# Altium schematic sheet Mainboard.SchDoc
size A3
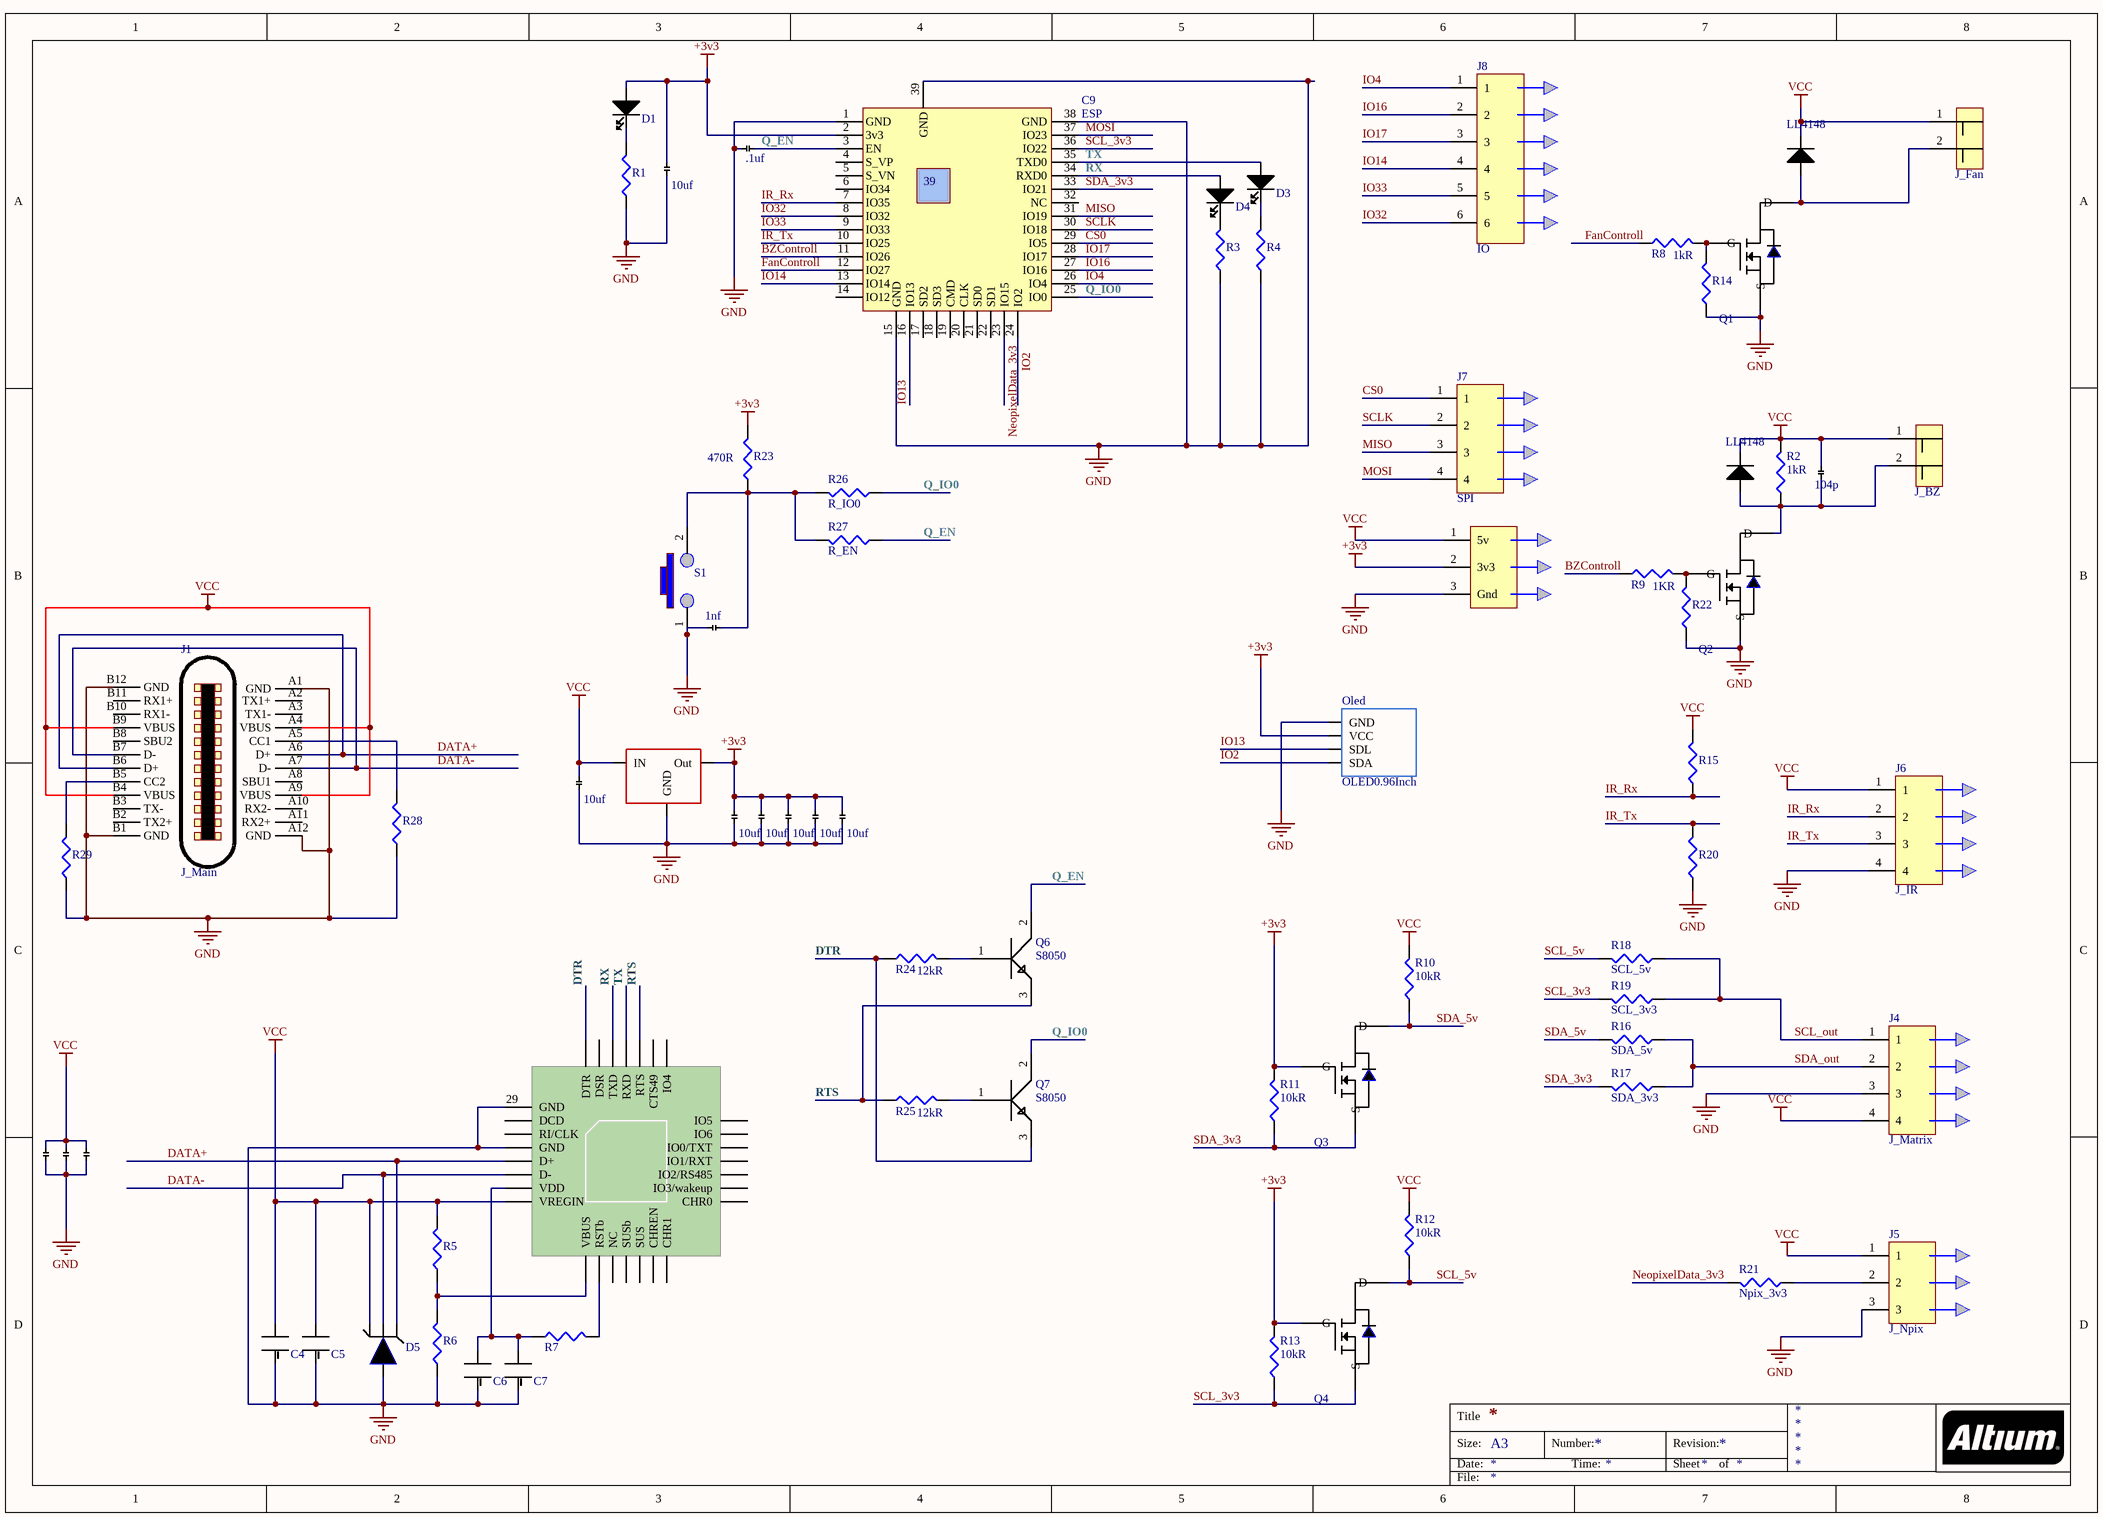
[diagram p0: Mainboard.SchDoc]

## Parts
C1  104p  [Capacitor0805]
C2  104p  [Capacitor0805]  (value not drawn)
C3  104p  [Capacitor0805]  (value not drawn)
C4  C4R7  [Capacitor0603]  (value not drawn)
C5  C104  [Capacitor0603]  (value not drawn)
C6  C104  [Capacitor0603]  (value not drawn)
C7  C4R7  [Capacitor0603]  (value not drawn)
C8  104p  [Capacitor0805]  (value not drawn)
C9  ESP  [ESP_WROOM_32_BARED_CHIP]
C10  1nf  [Capacitor0805]
C11  10uf  [Capacitor0805]
C12  10uf  [Capacitor0805]
C13  10uf  [Capacitor0805]
C14  10uf  [Capacitor0805]
C15  10uf  [Capacitor0805]
C16  10uf  [Capacitor0805]
C17  10uf  [Capacitor0805]
C18  .1uf  [Capacitor0805]
cp1  CP2102N  [CP2102N_QFN28]  (value not drawn)
D1  ESP  [LED0603]  (value not drawn)
D2  LL4148  [SOD80-LL4148]
D3  TXD  [LED0603]  (value not drawn)
D4  RXD  [LED0603]  (value not drawn)
D5  SP0503BAHTG  [SP0503BAHTG - SOT143-4]  (value not drawn)
D6  LL4148  [SOD80-LL4148]
J1  J_Main  [USB_C_24P_SMT]
J2  J_BZ  [1x2 S2B-XH]
J3  J_Fan  [1x2 S2B-XH]
J4  J_Matrix  [1x4 DUPONT RightAngle]
J5  J_Npix  [1x3 2.54 big chunk verticle]
J6  J_IR  [Xh 2.54 4 Pin Right]
J7  SPI  [1x4 DUPONT RightAngle]
J8  IO  [1x6 dupont right angle]
J9  power  [1x3 dupont right angle]  (value not drawn)
Oled  OLED0.96Inch  [0.96OLED]
Q1  Bss133  [SOT_23]  (value not drawn)
Q2  Bss133  [SOT_23]  (value not drawn)
Q3  Bss133  [SOT_23]  (value not drawn)
Q4  Bss133  [SOT_23]  (value not drawn)
Q5  lm1117  [SOT-223]  (value not drawn)
Q6  S8050  [SOT_23]
Q7  S8050  [SOT_23]
R1  360R  [R0805]  (value not drawn)
R2  1kR  [R0805]
R3  R360  [R0805]  (value not drawn)
R4  R360  [R0805]  (value not drawn)
R5  R2212  [R0805]  (value not drawn)
R6  R4752  [R0805]  (value not drawn)
R7  R102  [R0805]  (value not drawn)
R8  1kR  [R0805]
R9  1KR  [R0805]
R10  10kR  [R0805]
R11  10kR  [R0805]
R12  10kR  [R0805]
R13  10kR  [R0805]
R14  10kR  [R0805]  (value not drawn)
R15  10kR  [R0805]  (value not drawn)
R16  SDA_5v  [R0805]
R17  SDA_3v3  [R0805]
R18  SCL_5v  [R0805]
R19  SCL_3v3  [R0805]
R20  10kR  [R0805]  (value not drawn)
R21  Npix_3v3  [R0805]
R22  10kR  [R0805]  (value not drawn)
R23  470R  [R0805]
R24  12kR  [R0805]
R25  12kR  [R0805]
R26  R_IO0  [R0805]
R27  R_EN  [R0805]
R28  R5.1k  [R0805]  (value not drawn)
R29  R5.1k  [R0805]  (value not drawn)
S1  RST  (value not drawn)

## Nets
+3v3: C9.2(3v3) C12.1(-) C13.1(-) C14.1(-) C15.1(-) C16.1(-) C17.1(-) D1.2 J9.2(3v3) Oled.2(VCC) Q3.1(G) Q4.1(G) Q5.2(Out) R11.2 R13.2 R23.2
GND: C2.1(-) C3.1(-) C4.1(-) C5.1(-) C6.1(-) C7.1(-) C8.1(-) C9.1(GND) C9.15(GND) C9.38(GND) C9.39(GND) C10.2(+) C11.2(+) C12.2(+) C13.2(+) C14.2(+) C15.2(+) C16.2(+) C17.2(+) C18.1(-) cp1.3(GND) cp1.29(GND) D5.1(+) J1.A1(GND) J1.A12(GND) J1.B1(GND) J1.B12(GND) J4.3 J5.3 J6.4 J9.3(Gnd) Oled.1(GND) Q1.3(S) Q2.3(S) Q5.1(GND) R1.1 R3.1 R4.1 R6.1 R14.1 R20.1 R22.1 R28.1 R29.1 S1.1
VCC: C1.2(+) C2.2(+) C3.2(+) C4.2(+) C5.2(+) C8.2(+) C11.1(-) cp1.7(VREGIN) D2.1 D5.4 D6.1 J1.A4(VBUS) J1.A9(VBUS) J1.B4(VBUS) J1.B9(VBUS) J2.1 J3.1 J4.4 J5.1 J6.1 J9.1(5v) Q5.3(IN) R2.2 R5.2 R10.2 R12.2 R15.2
BZControll: C9.11(IO26) R9.1
CS0: C9.29(IO5) J7.1
DATA+: cp1.4(D+) D5.2 J1.A6(D+) J1.B6(D+)
DATA-: cp1.5(D-) D5.3 J1.A7(D-) J1.B7(D-)
DTR: cp1.28(DTR) Q7.3 R24.1
FanControll: C9.12(IO27) R8.1
IO2: C9.24(IO2) Oled.4(SDA)
IO4: C9.26(IO4) J8.1
IO13: C9.16(IO13) Oled.3(SDL)
IO14: C9.13(IO14) J8.4
IO16: C9.27(IO16) J8.2
IO17: C9.28(IO17) J8.3
IO32: C9.8(IO32) J8.6
IO33: C9.9(IO33) J8.5
IR_Rx: C9.7(IO35) J6.2 R15.1
IR_Tx: C9.10(IO25) J6.3 R20.2
MISO: C9.31(IO19) J7.3
MOSI: C9.37(IO23) J7.4
NeopixelData_3v3: C9.23(IO15) R21.2
Q_EN: C9.3(EN) C18.2(+) Q6.2 R27.1
Q_IO0: C9.25(IO0) Q7.2 R26.1
RTS: cp1.24(RTS) Q6.3 R25.1
RX: C9.34(RXD0) cp1.26(TXD) D4.2
SCL_3v3: C9.36(IO22) Q4.3(S) R13.1 R19.2
SCL_5v: Q4.2(D) R12.1 R18.2
SCL_out: J4.1 R18.1 R19.1
SCLK: C9.30(IO18) J7.2
SDA_3v3: C9.33(IO21) Q3.3(S) R11.1 R17.2
SDA_5v: Q3.2(D) R10.1 R16.2
SDA_out: J4.2 R16.1 R17.1
TX: C9.35(TXD0) cp1.25(RXD) D3.2
NetC1_1: C1.1(-) D6.2 J2.2 Q2.2(D) R2.1
NetC6_2: C6.2(+) C7.2(+) cp1.6(VDD) R7.1
NetC10_1: C10.1(-) R23.1 R26.2 R27.2 S1.2
Netcp1_8: cp1.8(VBUS) R5.1 R6.2
Netcp1_9: cp1.9(RSTb) R7.2
NetD1_1: D1.1 R1.2
NetD2_2: D2.2 J3.2 Q1.2(D)
NetD3_1: D3.1 R4.2
NetD4_1: D4.1 R3.2
NetJ1_A5: J1.A5(CC1) R28.2
NetJ1_B5: J1.B5(CC2) R29.2
NetJ5_2: J5.2 R21.1
NetQ1_1: Q1.1(G) R8.2 R14.2
NetQ2_1: Q2.1(G) R9.2 R22.2
NetQ6_1: Q6.1 R24.2
NetQ7_1: Q7.1 R25.2

Not connected (* = marked no-connect by the designer): C9 4(S_VP) 5(S_VN) 6(IO34) 14(IO12) 17(SD2) 18(SD3) 19(CMD) 20(CLK) 21(SD0) 22(SD1) 32(NC); cp1 1(DCD) 2(RI/CLK) 10(NC) 11(SUSb) 12(SUS) 13(CHREN) 14(CHR1) 15(CHR0) 16(IO3/wakeup) 17(IO2/RS485) 18(IO1/RXT) 19(IO0/TXT) 20(IO6) 21(IO5) 22(IO4) 23(CTS49) 27(DSR); J1 A2(TX1+) A3(TX1-) A8(SBU1) A10(RX2-) A11(RX2+) B2(TX2+) B3(TX-) B8(SBU2) B10(RX1-) B11(RX1+)

## Notes on the sheet
- Title
- Size:
- Date:
- A3
- Number:
- Time:
- Revision:
- Sheet
- of
- File:

## Library data of the parts
C1-C3 C8 C10-C18 = capacitor0.1uf: for leds and smol
C4 = capacitor0603: Cap Ceramic 4.7uF 6.3V X5R 20% Pad SMD 0402 85C T/R; Manufacturer 1: Murata; Manufacturer Part Number 1: GRM155R60J475ME87J; Supplier 1: Digi-Key; RoHS: No; Category: Ceramic Capacitors; Stock 1: 206568; Pricing 1: 1=0.16000, 10=0.11100, 50=0.06280, 100=0.05210, 500=0.03654, 1000=0.03025, 2500=0.02815, 5000=0.02575 (USD); Capacitance: 4.7uF; Tolerance: 20%; Dielectric: X5R; Voltage Rating (DC): 6.3V; Length: 1mm; Thickness: 500um; Width: 500um; ComponentLink1URL: https://search.murata.co.jp/Ceramy/image/img/A01X/G101/ENG/GRM155R60J475ME87-01.pdf?src-supplier=Digi-Key; ComponentLink1Description: https://search.murata.co.jp/Ceramy/image/img/A01X/G101/ENG/GRM155R60J475ME87-01.pdf?src-supplier=Digi-Key; Supplier Part Number 1: 490-18211-1-ND
C5 = capacitor0603: 0.1uf; Manufacturer 1: Murata; Manufacturer Part Number 1: GRM155R60J475ME87J; Capacitance: 4.7uF; Tolerance: 20%; Dielectric: X5R; Voltage Rating (DC): 6.3V; Supplier 1: Digi-Key; RoHS: No; Category: Ceramic Capacitors; Stock 1: 206568; Pricing 1: 1=0.16000, 10=0.11100, 50=0.06280, 100=0.05210, 500=0.03654, 1000=0.03025, 2500=0.02815, 5000=0.02575 (USD); Length: 1mm; Thickness: 500um; Width: 500um; ComponentLink1URL: https://search.murata.co.jp/Ceramy/image/img/A01X/G101/ENG/GRM155R60J475ME87-01.pdf?src-supplier=Digi-Key; ComponentLink1Description: https://search.murata.co.jp/Ceramy/image/img/A01X/G101/ENG/GRM155R60J475ME87-01.pdf?src-supplier=Digi-Key; Supplier Part Number 1: 490-18211-1-ND
C6 = capacitor0603: 4.7; Manufacturer 1: Murata; Manufacturer Part Number 1: GRM155R60J475ME87J; Capacitance: 4.7uF; Tolerance: 20%; Dielectric: X5R; Voltage Rating (DC): 6.3V; Supplier 1: Digi-Key; RoHS: No; Category: Ceramic Capacitors; Stock 1: 206568; Pricing 1: 1=0.16000, 10=0.11100, 50=0.06280, 100=0.05210, 500=0.03654, 1000=0.03025, 2500=0.02815, 5000=0.02575 (USD); Length: 1mm; Thickness: 500um; Width: 500um; ComponentLink1URL: https://search.murata.co.jp/Ceramy/image/img/A01X/G101/ENG/GRM155R60J475ME87-01.pdf?src-supplier=Digi-Key; ComponentLink1Description: https://search.murata.co.jp/Ceramy/image/img/A01X/G101/ENG/GRM155R60J475ME87-01.pdf?src-supplier=Digi-Key; Supplier Part Number 1: 490-18211-1-ND
C7 = capacitor0603: 0.1; Manufacturer 1: Murata; Manufacturer Part Number 1: GRM155R60J475ME87J; Capacitance: 4.7uF; Tolerance: 20%; Dielectric: X5R; Voltage Rating (DC): 6.3V; Supplier 1: Digi-Key; RoHS: No; Category: Ceramic Capacitors; Stock 1: 206568; Pricing 1: 1=0.16000, 10=0.11100, 50=0.06280, 100=0.05210, 500=0.03654, 1000=0.03025, 2500=0.02815, 5000=0.02575 (USD); Length: 1mm; Thickness: 500um; Width: 500um; ComponentLink1URL: https://search.murata.co.jp/Ceramy/image/img/A01X/G101/ENG/GRM155R60J475ME87-01.pdf?src-supplier=Digi-Key; ComponentLink1Description: https://search.murata.co.jp/Ceramy/image/img/A01X/G101/ENG/GRM155R60J475ME87-01.pdf?src-supplier=Digi-Key; Supplier Part Number 1: 490-18211-1-ND
C9 = ESP_wroom32_bared_chip
cp1 = CP2102N-A02-GQFN28R: Full Speed USB to UART Bridge USB 2.0 3.3V T/R Automotive 28-Pin QFN EP; Manufacturer 1: Silicon Labs; Supplier 1: Digi-Key; Manufacturer Part Number 1: CP2102N-A02-GQFN28R; RoHS: No; Stock 1: 1682; Pricing 1: 1=1.40000, 25=1.35160, 100=1.29950 (USD); Supplier Part Number 1: 336-5890-1-ND
D1 D3 D4 = LTST-C190TBKT: LED BLUE CLEAR CHIP SMD; Manufacturer 1: Vishay Lite-On; Lens Color: Colorless; Viewing Angle: 130°; Forward Voltage: 3.8V; Lens Style: Diffused,Colorless,Clear,Rectangular; Luminous Intensity: 180mcd; Forward Current: 20mA; Dominant Wavelength: 475nm; Number of Elements: 1; Power Dissipation: 76mW; Wavelength: 468nm; Reverse Voltage: 5V; Supplier 1: Digi-Key; Manufacturer Part Number 1: LTST-C190TBKT; RoHS: Yes; Category: LEDs; Stock 1: 76203; Pricing 1: 1=0.50000, 10=0.35600, 100=0.15840, 500=0.11088, 1000=0.09108 (USD); Mount: Surface Mount; Case/Package: 0603; Number of Pins: 2; Color: Blue; Case Code (Metric): 1608; Case Code (Imperial): 0603; Min Operating Temperature: -20°C; Max Operating Temperature: 80°C; Packaging: Tape and Reel; Package Quantity: 1; Illumination Color: Blue; Test Current: 20mA; Lens Transparency: Clear; Number of LEDs: 1; Length: 1.6mm; Height: 0.8mm; Width: 0.8mm; Depth: 0.8mm; Radiation Hardening: No; Lead Free: Lead Free; ComponentLink1URL: https://datasheet.ciiva.com/16353/lite-on20ltst-c190tbkt-16353409.pdf?src-supplier=Future+Electronics; ComponentLink1Description: https://datasheet.ciiva.com/16353/lite-on20ltst-c190tbkt-16353409.pdf?src-supplier=Future+Electronics; ComponentLink2URL: https://datasheet.ciiva.com/15117/getdatasheetpartid-131310-15117667.pdf?src-supplier=Verical; ComponentLink2Description: https://datasheet.ciiva.com/15117/getdatasheetpartid-131310-15117667.pdf?src-supplier=Verical; ComponentLink3URL: https://datasheet.ciiva.com/2110/ltst-c190tbkt-2110473.pdf?src-supplier=Digi-Key; ComponentLink3Description: https://datasheet.ciiva.com/2110/ltst-c190tbkt-2110473.pdf?src-supplier=Digi-Key; ComponentLink4URL: https://datasheet.ciiva.com/12400/lite-on-ltst-c190tbkt-187381-12400873.pdf?src-supplier=Mouser; ComponentLink4Description: https://datasheet.ciiva.com/12400/lite-on-ltst-c190tbkt-187381-12400873.pdf?src-supplier=Mouser; ComponentLink5URL: https://datasheet.ciiva.com/11774/0900766b80dc02ab-11774378.pdf?src-supplier=RSComponents; ComponentLink5Description: https://datasheet.ciiva.com/11774/0900766b80dc02ab-11774378.pdf?src-supplier=RSComponents; ComponentLink6URL: https://datasheet.ciiva.com/26913/ltst-c190tbkt-26913716.pdf?src-supplier=IIIC; ComponentLink6Description: https://datasheet.ciiva.com/26913/ltst-c190tbkt-26913716.pdf?src-supplier=IIIC; ComponentLink7URL: https://datasheet.ciiva.com/2110/s-110-ltst-c190tbkt0630-2110475.pdf?src-supplier=Digi-Key; ComponentLink7Description: https://datasheet.ciiva.com/2110/s-110-ltst-c190tbkt0630-2110475.pdf?src-supplier=Digi-Key; ComponentLink8Description: 橘色的; ComponentLink8URL: https://www.digikey.tw/product-detail/zh/lite-on-inc/LTST-C191KFKT/160-1445-1-ND/386832
D2 D6 = LL4148: ON SEMICONDUCTOR - LL4148 - Small Signal Diode, Single, 100 V, 200 mA, 1 V, 4 ns, 2 A; Manufacturer 1: ON Semiconductor / Fairchild; Average Rectified Current: 200mA; Max Repetitive Reverse Voltage (Vrrm): 100V; Max Surge Current: 2A; Forward Voltage: 1V; Max Reverse Current: 25nA; Recovery Time: 4ns; Power Dissipation: 500mW; Supplier 1: Digi-Key; Manufacturer Part Number 1: LL4148; RoHS: Yes; Category: Rectifier Diodes; Stock 1: 428902; Pricing 1: 1=0.10000, 10=0.08400, 100=0.03220, 500=0.02346, 1000=0.01575 (USD); Mount: Surface Mount; Number of Pins: 2; Weight: 0.01lb; Contact Plating: Tin,Matte; Min Operating Temperature: -65°C; Max Operating Temperature: 175°C; Packaging: Tape and Reel; Package Quantity: 2500; Forward Current: 200mA; Reverse Recovery Time: 4ns; Peak Non-Repetitive Surge Current: 2A; Max Forward Surge Current (Ifsm): 2A; Element Configuration: Single; Voltage: 100V; Max Reverse Voltage (DC): 100V; Reverse Voltage: 100V; Length: 3.6mm; Width: 1.5mm; Height: 1.5mm; Radiation Hardening: No; REACH SVHC: No SVHC; Lead Free: Lead Free; ComponentLink1URL: https://datasheet.ciiva.com/1181/1730036-1181026.pdf?src-supplier=Element14; ComponentLink1Description: https://datasheet.ciiva.com/1181/1730036-1181026.pdf?src-supplier=Element14; ComponentLink2URL: https://datasheet.ciiva.com/8303/ll4148-8303779.pdf?src-supplier=Avnet; ComponentLink2Description: https://datasheet.ciiva.com/8303/ll4148-8303779.pdf?src-supplier=Avnet; ComponentLink3URL: https://datasheet.ciiva.com/27048/94908-27048041.pdf?src-supplier=Jameco; ComponentLink3Description: https://datasheet.ciiva.com/27048/94908-27048041.pdf?src-supplier=Jameco; ComponentLink4URL: https://datasheet.ciiva.com/4453/ll4148-70504-4453114.pdf?src-supplier=Mouser; ComponentLink4Description: https://datasheet.ciiva.com/4453/ll4148-70504-4453114.pdf?src-supplier=Mouser; ComponentLink5URL: https://datasheet.ciiva.com/910/ll4148-910343.pdf?src-supplier=Digi-Key; ComponentLink5Description: https://datasheet.ciiva.com/910/ll4148-910343.pdf?src-supplier=Digi-Key; ComponentLink6URL: https://datasheet.ciiva.com/910/ll4148-910344.pdf?src-supplier=Digi-Key; ComponentLink6Description: https://datasheet.ciiva.com/910/ll4148-910344.pdf?src-supplier=Digi-Key; ComponentLink7URL: https://datasheet.ciiva.com/910/ll4148-910345.pdf?src-supplier=Digi-Key; ComponentLink7Description: https://datasheet.ciiva.com/910/ll4148-910345.pdf?src-supplier=Digi-Key; ComponentLink8URL: https://datasheet.ciiva.com/22735/1896420-22735578.pdf?src-supplier=Element14; ComponentLink8Description: https://datasheet.ciiva.com/22735/1896420-22735578.pdf?src-supplier=Element14; ComponentLink9URL: https://datasheet.ciiva.com/26912/getdatasheetpartid-110057-26912779.pdf?src-supplier=Verical; ComponentLink9Description: https://datasheet.ciiva.com/26912/getdatasheetpartid-110057-26912779.pdf?src-supplier=Verical; ComponentLink10URL: https://datasheet.ciiva.com/8053/1896420-8053645.pdf?src-supplier=Element14; ComponentLink10Description: https://datasheet.ciiva.com/8053/1896420-8053645.pdf?src-supplier=Element14; Supplier Part Number 1: LL4148FSCT-ND
D5 = SP0503BAHTG: ESD Suppressor TVS 5.5V 4-Pin(3+Tab) SOT-143 T/R; Manufacturer 1: Littelfuse; Element Configuration: Common Anode; Direction: Unidirectional; Capacitance: 30pF; Number of Channels: 3; Clamping Voltage: 8.5V; Power Line Protection: No; Polarity: Bidirectional,Unidirectional; Max Power Dissipation: 225mW; ESD Protection: Yes; Max Reverse Leakage Current: 100nA; Voltage Rating (DC): 5V; Diode Type: Avalanche; Supplier 1: Digi-Key; Manufacturer Part Number 1: SP0503BAHTG; RoHS: Yes; Category: Diodes; Stock 1: 63906; Pricing 1: 1=0.80000, 10=0.66000, 100=0.51120, 500=0.38340, 1000=0.30885 (USD); Mount: Surface Mount; Case/Package: SOT-143; Number of Pins: 4; Min Operating Temperature: -40°C; Max Operating Temperature: 85°C; Operating Supply Voltage: 5.5V; Packaging: Tape and Reel; Number of Unidirectional Channels: 3; Reverse Standoff Voltage: 5.5V; Breakdown Voltage: 5.5V; Termination: SMD/SMT; Working Voltage: 5.5V; Peak Pulse Power: 225mW; Leakage Current: 100nA; Number of Elements: 3; Power Dissipation: 225mW; Resistor Type: Zener; Length: 3.04mm; Height: 1.05mm; Width: 1.4mm; Depth: 1.4mm; Radiation Hardening: No; REACH SVHC: No SVHC; Lead Free: Lead Free; ComponentLink1URL: https://datasheet.ciiva.com/15143/getdatasheetpartid-116020-15143550.pdf?src-supplier=Verical; ComponentLink1Description: https://datasheet.ciiva.com/15143/getdatasheetpartid-116020-15143550.pdf?src-supplier=Verical; ComponentLink2URL: https://datasheet.ciiva.com/332/sp05xxba-332550.pdf?src-supplier=Digi-Key; ComponentLink2Description: https://datasheet.ciiva.com/332/sp05xxba-332550.pdf?src-supplier=Digi-Key; ComponentLink3URL: https://datasheet.ciiva.com/8062/littefuse-spa-sp050x-8062422.pdf?src-supplier=Element14; ComponentLink3Description: https://datasheet.ciiva.com/8062/littefuse-spa-sp050x-8062422.pdf?src-supplier=Element14; ComponentLink4URL: https://datasheet.ciiva.com/22697/1911798-22697942.pdf?src-supplier=Element14; ComponentLink4Description: https://datasheet.ciiva.com/22697/1911798-22697942.pdf?src-supplier=Element14; ComponentLink5URL: https://datasheet.ciiva.com/332/sp05xxba-332551.pdf?src-supplier=Digi-Key; ComponentLink5Description: https://datasheet.ciiva.com/332/sp05xxba-332551.pdf?src-supplier=Digi-Key; ComponentLink6URL: https://datasheet.ciiva.com/16449/sp05xxba-16449463.pdf?src-supplier=Future+Electronics; ComponentLink6Description: https://datasheet.ciiva.com/16449/sp05xxba-16449463.pdf?src-supplier=Future+Electronics; ComponentLink7URL: https://datasheet.ciiva.com/332/sp05xxba-332552.pdf?src-supplier=Digi-Key; ComponentLink7Description: https://datasheet.ciiva.com/332/sp05xxba-332552.pdf?src-supplier=Digi-Key; ComponentLink8URL: https://datasheet.ciiva.com/4509/sp05x-leadfree-4509162.pdf?src-supplier=Mouser; ComponentLink8Description: https://datasheet.ciiva.com/4509/sp05x-leadfree-4509162.pdf?src-supplier=Mouser; ComponentLink9URL: https://datasheet.ciiva.com/7650/526672-7650894.pdf?src-supplier=Element14; ComponentLink9Description: https://datasheet.ciiva.com/7650/526672-7650894.pdf?src-supplier=Element14; Supplier Part Number 1: F2715CT-ND
J1 = USB_TypeC_24P: ComponentLink1Description: example; ComponentLink1URL: https://github.com/Xinyuan-LilyGO/TTGO-T-Display/blob/master/schematic/ESP32-TFT(6-26).pdf
J2 J3 = S2B-XH: ComponentLink1Description: Sales Page; ComponentLink1URL: https://www.digikey.com/en/products/detail/jst-sales-america-inc/S2B-XH-A-LF-SN/1651055; ComponentLink2Description: dataSheet; ComponentLink2URL: https://www.jst-mfg.com/product/pdf/eng/eXH.pdf
J4 = 1x4 dupont general
J5 = 1x3 2.54 chunk verticle: ComponentLink1Description: vender; ComponentLink1URL: https://www.digikey.tw/product-detail/zh/sullins-connector-solutions/SWR25X-NRTC-S03-RB-BA/S9403-ND/2769661; ComponentLink2Description: model; ComponentLink2URL: https://www.3dcontentcentral.tw/secure/Download-Partner-Model.aspx?partner=TraceParts&name=WR-WTB+2%2c54mm+Left+Angle+Header+3+pin&lang=zh&catalogid=11913&id=882182&parturl=https%3a%2f%2fwww.traceparts.com%2fels%2f3dcc%2fgoto%3fProduct%3d10-11012018-134514%26configuratorType%3dtable%26showBomFields%3dtrue%26showSlides%3d3Dviewer%2cPictures%2cDimensionDrawings%2cECAD%26tp_p1%3d%7b1%7d
J6 J7 = 1x4 general Header
J8 = 1x6 general dupont
J9 = 1x3 dupont power
Q1-Q4 = Bss138 Mosfet
Q5 = LM1117-3.3v
Q6 Q7 = S8050NPN
R1 = CRCW0805360RFKEA: Res Thick Film 0805 360 Ohm 1% 0.125W(1/8W) ±100ppm/C Molded SMD Automotive Paper T/R; Manufacturer 1: Vishay; Temperature Coefficient: 100ppm/°C; Max Power Dissipation: 125mW; Voltage Rating (DC): 150V; Supplier 1: Digi-Key; Manufacturer Part Number 1: CRCW0805360RFKEA; RoHS: Yes; Category: Chip SMD Resistors; Stock 1: 25005; Pricing 1: 1=0.10000, 10=0.06000, 100=0.02450, 1000=0.01102, 2500=0.00957 (USD); Case/Package: 0805; Number of Pins: 2; Weight: 0.000194oz; Case Code (Metric): 2012; Case Code (Imperial): 0805; Contact Plating: Tin; Number of Terminals: 2; Min Operating Temperature: -55°C; Max Operating Temperature: 155°C; Resistance: 360R; Tolerance: 1%; Packaging: Tape and Reel; Composition: Thick Film; Package Quantity: 10; Number of Terminations: 2; Features: Automotive AEC-Q200; Power Rating: 125mW; Voltage Rating: 150V; Termination: SMD/SMT; Military Standard: Not; Length: 2mm; Height: 0.45mm; Width: 0.049inch; Depth: 1.25mm; Radiation Hardening: No; Lead Free: Lead Free; REACH SVHC: Unknown; ComponentLink1URL: https://datasheet.ciiva.com/2467/dcrcwe3-2467773.pdf?src-supplier=Digi-Key; ComponentLink1Description: https://datasheet.ciiva.com/2467/dcrcwe3-2467773.pdf?src-supplier=Digi-Key; Supplier Part Number 1: 541-360CCT-ND
R2 R5 R6 R8-R13 R16-R19 R21 R24 R25 R28 R29 = resistor(CRCW0805360RFKEA: Res Thick Film 0805 360 Ohm 1% 0.125W(1/8W) ±100ppm/C Molded SMD Automotive Paper T/R; Manufacturer 1: Vishay; Resistance: 360R; Temperature Coefficient: 100ppm/°C; Max Power Dissipation: 125mW; Voltage Rating (DC): 150V; Supplier 1: Digi-Key; Manufacturer Part Number 1: CRCW0805360RFKEA; RoHS: Yes; Category: Chip SMD Resistors; Stock 1: 25005; Pricing 1: 1=0.10000, 10=0.06000, 100=0.02450, 1000=0.01102, 2500=0.00957 (USD); Case/Package: 0805; Number of Pins: 2; Weight: 0.000194oz; Case Code (Metric): 2012; Case Code (Imperial): 0805; Contact Plating: Tin; Number of Terminals: 2; Min Operating Temperature: -55°C; Max Operating Temperature: 155°C; Tolerance: 1%; Packaging: Tape and Reel; Composition: Thick Film; Package Quantity: 10; Number of Terminations: 2; Features: Automotive AEC-Q200; Power Rating: 125mW; Voltage Rating: 150V; Termination: SMD/SMT; Military Standard: Not; Length: 2mm; Height: 0.45mm; Width: 0.049inch; Depth: 1.25mm; Radiation Hardening: No; Lead Free: Lead Free; REACH SVHC: Unknown; ComponentLink1URL: https://datasheet.ciiva.com/2467/dcrcwe3-2467773.pdf?src-supplier=Digi-Key; ComponentLink1Description: https://datasheet.ciiva.com/2467/dcrcwe3-2467773.pdf?src-supplier=Digi-Key; Supplier Part Number 1: 541-360CCT-ND
R3 R4 R14 R15 R20 R22 R23 R26 R27 = CRCW0805360RFKEA: Res Thick Film 0805 360 Ohm 1% 0.125W(1/8W) ±100ppm/C Molded SMD Automotive Paper T/R; Manufacturer 1: Vishay; Resistance: 360R; Temperature Coefficient: 100ppm/°C; Max Power Dissipation: 125mW; Voltage Rating (DC): 150V; Supplier 1: Digi-Key; Manufacturer Part Number 1: CRCW0805360RFKEA; RoHS: Yes; Category: Chip SMD Resistors; Stock 1: 25005; Pricing 1: 1=0.10000, 10=0.06000, 100=0.02450, 1000=0.01102, 2500=0.00957 (USD); Case/Package: 0805; Number of Pins: 2; Weight: 0.000194oz; Case Code (Metric): 2012; Case Code (Imperial): 0805; Contact Plating: Tin; Number of Terminals: 2; Min Operating Temperature: -55°C; Max Operating Temperature: 155°C; Tolerance: 1%; Packaging: Tape and Reel; Composition: Thick Film; Package Quantity: 10; Number of Terminations: 2; Features: Automotive AEC-Q200; Power Rating: 125mW; Voltage Rating: 150V; Termination: SMD/SMT; Military Standard: Not; Length: 2mm; Height: 0.45mm; Width: 0.049inch; Depth: 1.25mm; Radiation Hardening: No; Lead Free: Lead Free; REACH SVHC: Unknown; ComponentLink1URL: https://datasheet.ciiva.com/2467/dcrcwe3-2467773.pdf?src-supplier=Digi-Key; ComponentLink1Description: https://datasheet.ciiva.com/2467/dcrcwe3-2467773.pdf?src-supplier=Digi-Key; Supplier Part Number 1: 541-360CCT-ND
R7 = resistor(CRCW0805360RFKEA: 1Kohms; Manufacturer 1: Vishay; Resistance: 360R; Tolerance: 1%; Temperature Coefficient: 100ppm/°C; Max Power Dissipation: 125mW; Voltage Rating (DC): 150V; Supplier 1: Digi-Key; Manufacturer Part Number 1: CRCW0805360RFKEA; RoHS: Yes; Category: Chip SMD Resistors; Stock 1: 25005; Pricing 1: 1=0.10000, 10=0.06000, 100=0.02450, 1000=0.01102, 2500=0.00957 (USD); Case/Package: 0805; Number of Pins: 2; Weight: 0.000194oz; Case Code (Metric): 2012; Case Code (Imperial): 0805; Contact Plating: Tin; Number of Terminals: 2; Min Operating Temperature: -55°C; Max Operating Temperature: 155°C; Packaging: Tape and Reel; Composition: Thick Film; Package Quantity: 10; Number of Terminations: 2; Features: Automotive AEC-Q200; Power Rating: 125mW; Voltage Rating: 150V; Termination: SMD/SMT; Military Standard: Not; Length: 2mm; Height: 0.45mm; Width: 0.049inch; Depth: 1.25mm; Radiation Hardening: No; Lead Free: Lead Free; REACH SVHC: Unknown; ComponentLink1URL: https://datasheet.ciiva.com/2467/dcrcwe3-2467773.pdf?src-supplier=Digi-Key; ComponentLink1Description: https://datasheet.ciiva.com/2467/dcrcwe3-2467773.pdf?src-supplier=Digi-Key; Supplier Part Number 1: 541-360CCT-ND
S1 = Smol_switch